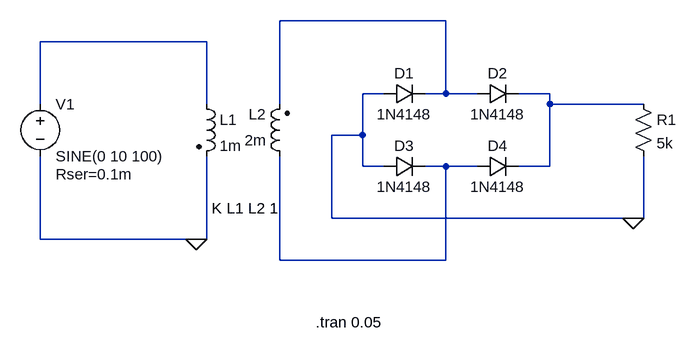
[diagram p0: schematic transformer1_ltspice.asc]
transformer1_ltspice.asc, the LTspice schematic file:
Version 4
SHEET 1 880 680
WIRE 176 -16 -80 -16
WIRE -192 16 -448 16
WIRE 80 96 48 96
WIRE 176 96 176 -16
WIRE 176 96 144 96
WIRE 224 96 176 96
WIRE 336 96 288 96
WIRE -448 112 -448 16
WIRE -192 112 -192 16
WIRE -80 112 -80 -16
WIRE 336 112 336 96
WIRE 480 112 336 112
WIRE 48 160 48 96
WIRE 48 160 0 160
WIRE 48 208 48 160
WIRE 80 208 48 208
WIRE 176 208 144 208
WIRE 224 208 176 208
WIRE 336 208 336 112
WIRE 336 208 288 208
WIRE 0 288 0 160
WIRE 464 288 0 288
WIRE 480 288 480 192
WIRE 480 288 464 288
WIRE -448 320 -448 192
WIRE -208 320 -448 320
WIRE -192 320 -192 192
WIRE -192 320 -208 320
WIRE -80 352 -80 192
WIRE 176 352 176 208
WIRE 176 352 -80 352
FLAG -208 320 0
FLAG 464 288 0
SYMBOL diode 80 112 R270
WINDOW 0 32 32 VTop 2
WINDOW 3 0 32 VBottom 2
SYMATTR InstName D1
SYMATTR Value 1N4148
SYMBOL diode 224 112 R270
WINDOW 0 32 32 VTop 2
WINDOW 3 0 32 VBottom 2
SYMATTR InstName D2
SYMATTR Value 1N4148
SYMBOL diode 80 224 R270
WINDOW 0 32 32 VTop 2
WINDOW 3 0 32 VBottom 2
SYMATTR InstName D3
SYMATTR Value 1N4148
SYMBOL diode 224 224 R270
WINDOW 0 32 32 VTop 2
WINDOW 3 0 32 VBottom 2
SYMATTR InstName D4
SYMATTR Value 1N4148
SYMBOL ind2 -208 96 R0
SYMATTR InstName L1
SYMATTR Value 1m
SYMATTR Type ind
SYMBOL ind2 -64 208 R180
WINDOW 0 36 80 Left 2
WINDOW 3 36 40 Left 2
SYMATTR InstName L2
SYMATTR Value 2m
SYMATTR Type ind
SYMBOL voltage -448 96 R0
WINDOW 123 0 0 Left 0
WINDOW 39 24 124 Left 2
SYMATTR InstName V1
SYMATTR Value SINE(0 10 100)
SYMATTR SpiceLine Rser=0.1m
SYMBOL res 464 96 R0
SYMATTR InstName R1
SYMATTR Value 5k
TEXT -184 272 Left 2 !K L1 L2 1
TEXT -24 448 Left 2 !.tran 0.05

The netlist it stands for:
* transformer1_ltspice.asc
D1 0 N001 1N4148
D2 N001 N003 1N4148
D3 0 N004 1N4148
D4 N004 N003 1N4148
L1 N002 0 1m
L2 N004 N001 2m
V1 N002 0 SINE(0 10 100) Rser=0.1m
R1 N003 0 5k
.model D D
.lib standard.dio
K L1 L2 1
.tran 0.05
.backanno
.end